# EasyEDA schematic BIT 0.json
TITLE: TRICORE | ALU | LOGIC; REV: 1.0; Date: 2022-01-05; Sheet: 2/9; Drawn By: Koehler, Paul; Company: komed3
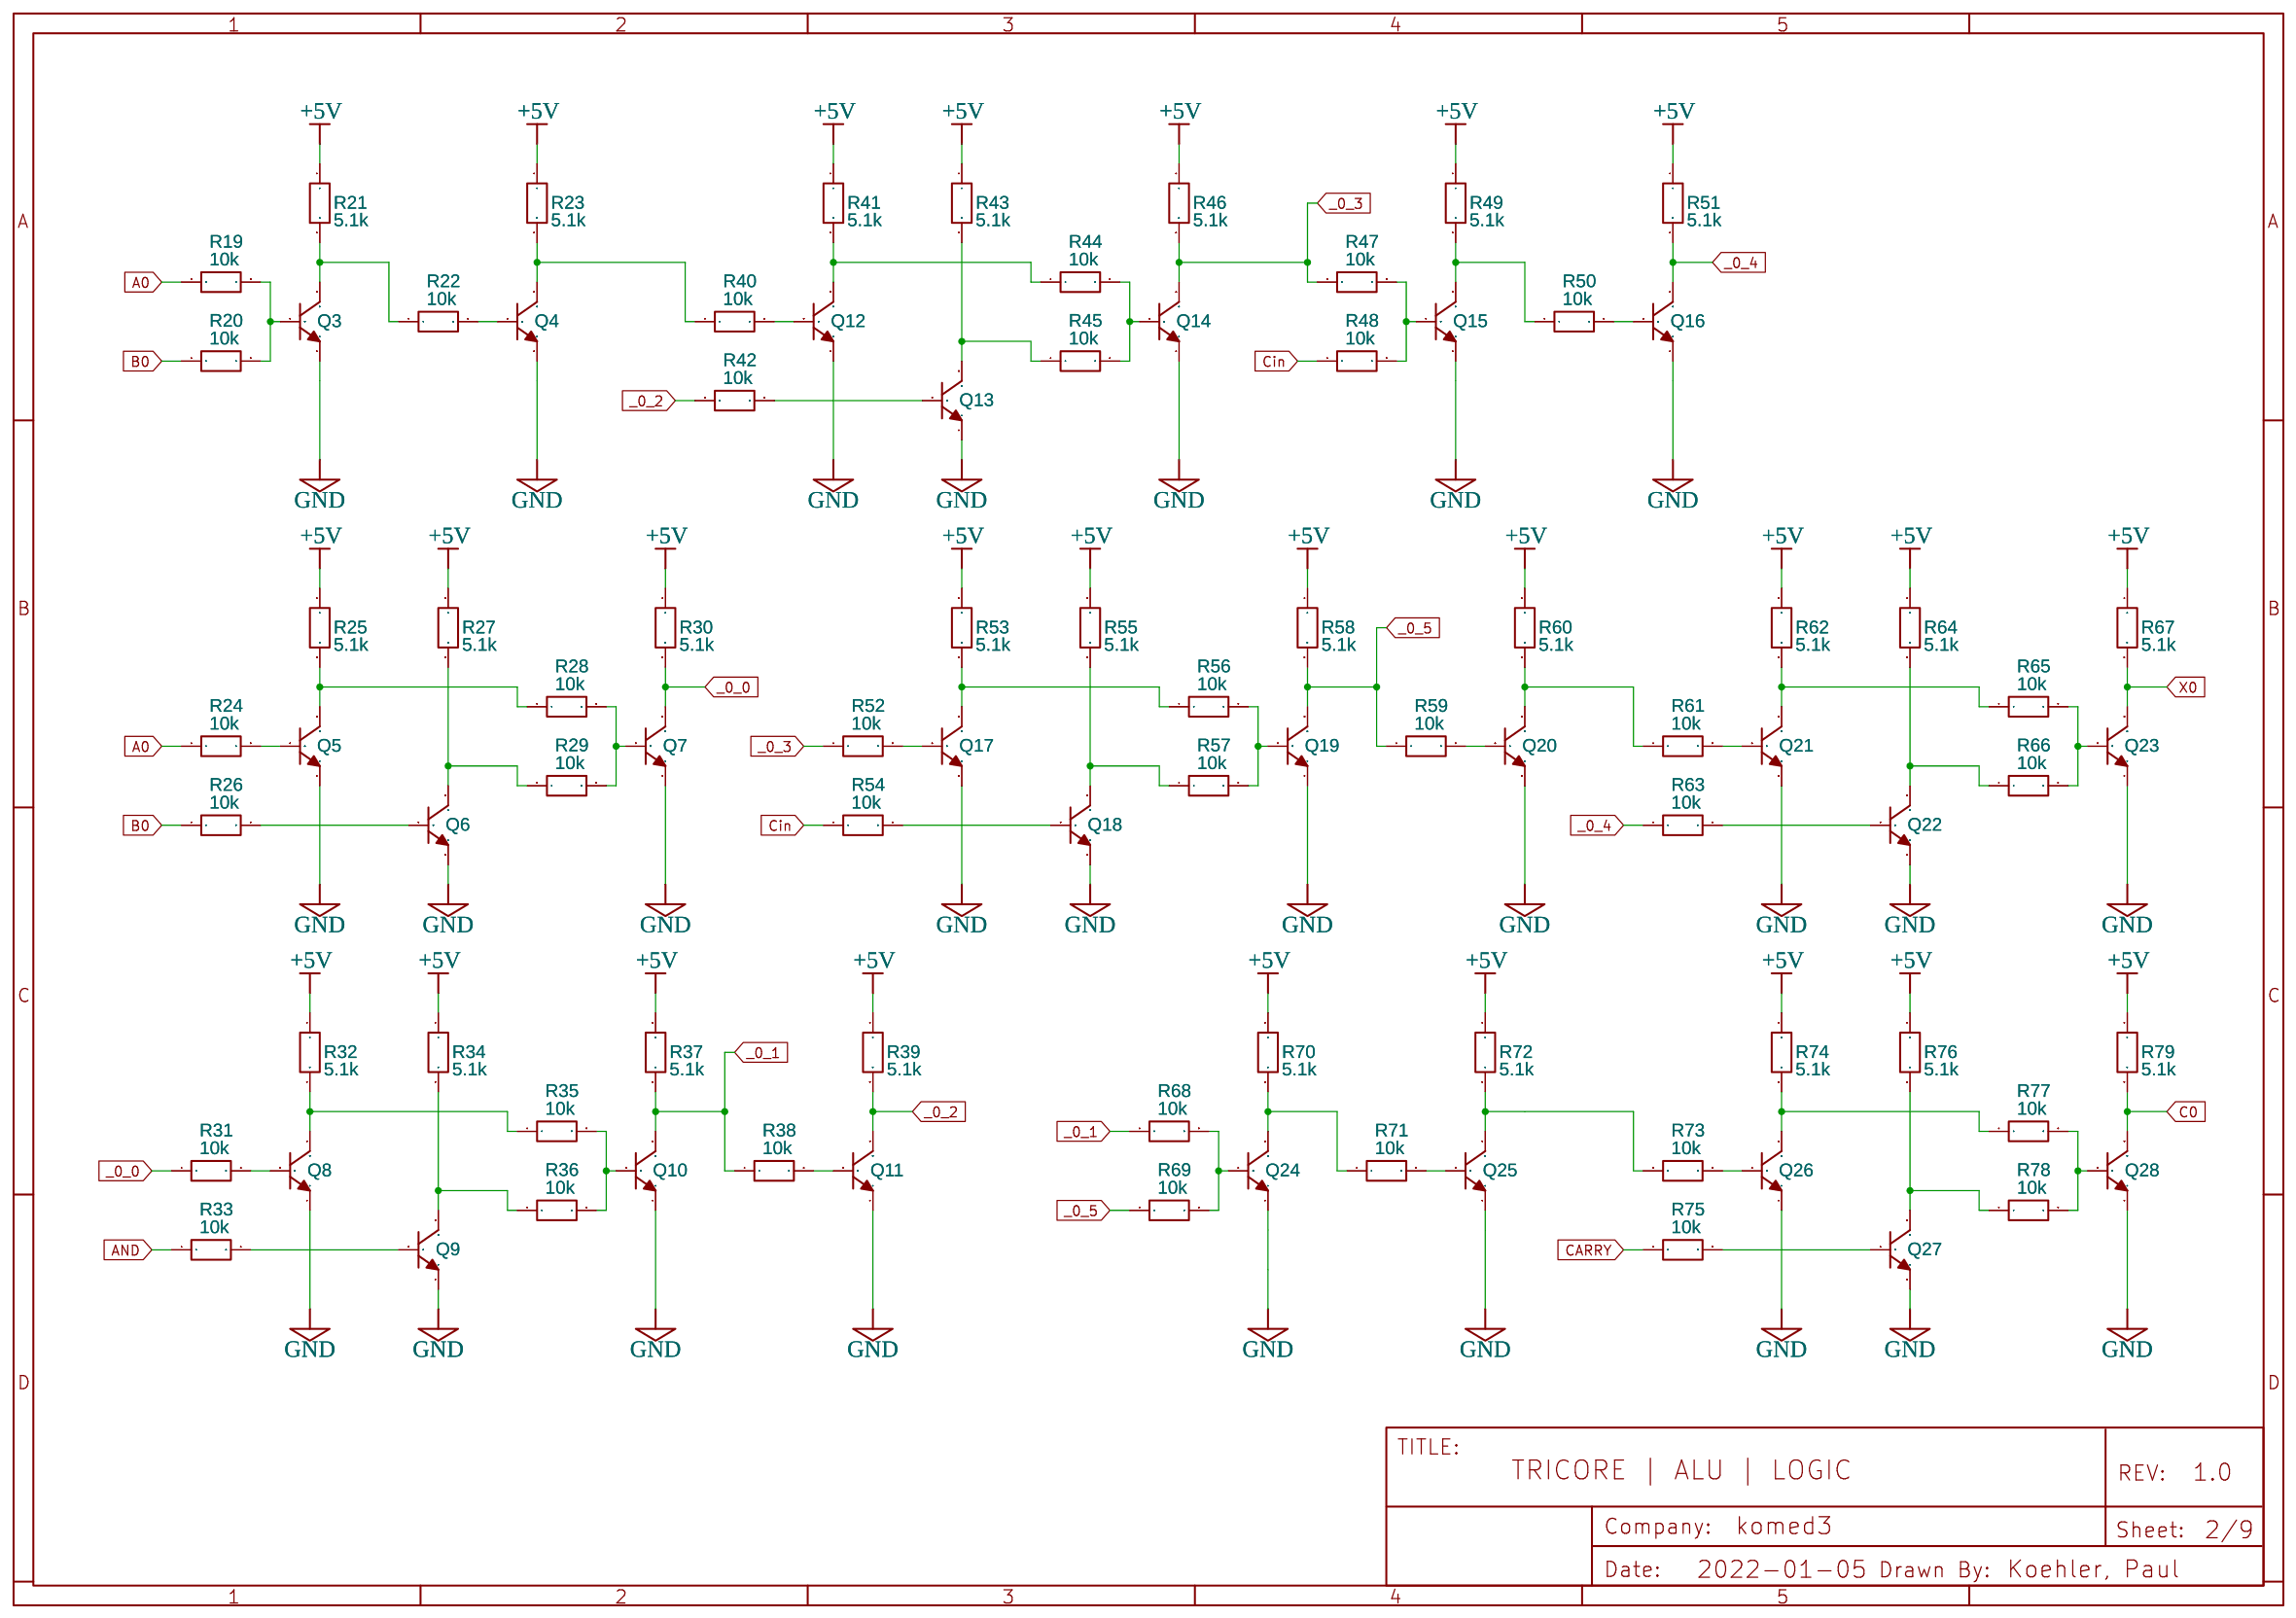
[diagram p0: schematic sheet]

## Parts
Q3  2N3904(TO-92)  [TO-92-3_L5.1-W4.1-P1.27-L]
Q4  2N3904(TO-92)  [TO-92-3_L5.1-W4.1-P1.27-L]
Q5  2N3904(TO-92)  [TO-92-3_L5.1-W4.1-P1.27-L]
Q6  2N3904(TO-92)  [TO-92-3_L5.1-W4.1-P1.27-L]
Q7  2N3904(TO-92)  [TO-92-3_L5.1-W4.1-P1.27-L]
Q8  2N3904(TO-92)  [TO-92-3_L5.1-W4.1-P1.27-L]
Q9  2N3904(TO-92)  [TO-92-3_L5.1-W4.1-P1.27-L]
Q10  2N3904(TO-92)  [TO-92-3_L5.1-W4.1-P1.27-L]
Q11  2N3904(TO-92)  [TO-92-3_L5.1-W4.1-P1.27-L]
Q12  2N3904(TO-92)  [TO-92-3_L5.1-W4.1-P1.27-L]
Q13  2N3904(TO-92)  [TO-92-3_L5.1-W4.1-P1.27-L]
Q14  2N3904(TO-92)  [TO-92-3_L5.1-W4.1-P1.27-L]
Q15  2N3904(TO-92)  [TO-92-3_L5.1-W4.1-P1.27-L]
Q16  2N3904(TO-92)  [TO-92-3_L5.1-W4.1-P1.27-L]
Q17  2N3904(TO-92)  [TO-92-3_L5.1-W4.1-P1.27-L]
Q18  2N3904(TO-92)  [TO-92-3_L5.1-W4.1-P1.27-L]
Q19  2N3904(TO-92)  [TO-92-3_L5.1-W4.1-P1.27-L]
Q20  2N3904(TO-92)  [TO-92-3_L5.1-W4.1-P1.27-L]
Q21  2N3904(TO-92)  [TO-92-3_L5.1-W4.1-P1.27-L]
Q22  2N3904(TO-92)  [TO-92-3_L5.1-W4.1-P1.27-L]
Q23  2N3904(TO-92)  [TO-92-3_L5.1-W4.1-P1.27-L]
Q24  2N3904(TO-92)  [TO-92-3_L5.1-W4.1-P1.27-L]
Q25  2N3904(TO-92)  [TO-92-3_L5.1-W4.1-P1.27-L]
Q26  2N3904(TO-92)  [TO-92-3_L5.1-W4.1-P1.27-L]
Q27  2N3904(TO-92)  [TO-92-3_L5.1-W4.1-P1.27-L]
Q28  2N3904(TO-92)  [TO-92-3_L5.1-W4.1-P1.27-L]
R19  10k  [R_AXIAL-0.3]
R20  10k  [R_AXIAL-0.3]
R21  5.1k  [R_AXIAL-0.3]
R22  10k  [R_AXIAL-0.3]
R23  5.1k  [R_AXIAL-0.3]
R24  10k  [R_AXIAL-0.3]
R25  5.1k  [R_AXIAL-0.3]
R26  10k  [R_AXIAL-0.3]
R27  5.1k  [R_AXIAL-0.3]
R28  10k  [R_AXIAL-0.3]
R29  10k  [R_AXIAL-0.3]
R30  5.1k  [R_AXIAL-0.3]
R31  10k  [R_AXIAL-0.3]
R32  5.1k  [R_AXIAL-0.3]
R33  10k  [R_AXIAL-0.3]
R34  5.1k  [R_AXIAL-0.3]
R35  10k  [R_AXIAL-0.3]
R36  10k  [R_AXIAL-0.3]
R37  5.1k  [R_AXIAL-0.3]
R38  10k  [R_AXIAL-0.3]
R39  5.1k  [R_AXIAL-0.3]
R40  10k  [R_AXIAL-0.3]
R41  5.1k  [R_AXIAL-0.3]
R42  10k  [R_AXIAL-0.3]
R43  5.1k  [R_AXIAL-0.3]
R44  10k  [R_AXIAL-0.3]
R45  10k  [R_AXIAL-0.3]
R46  5.1k  [R_AXIAL-0.3]
R47  10k  [R_AXIAL-0.3]
R48  10k  [R_AXIAL-0.3]
R49  5.1k  [R_AXIAL-0.3]
R50  10k  [R_AXIAL-0.3]
R51  5.1k  [R_AXIAL-0.3]
R52  10k  [R_AXIAL-0.3]
R53  5.1k  [R_AXIAL-0.3]
R54  10k  [R_AXIAL-0.3]
R55  5.1k  [R_AXIAL-0.3]
R56  10k  [R_AXIAL-0.3]
R57  10k  [R_AXIAL-0.3]
R58  5.1k  [R_AXIAL-0.3]
R59  10k  [R_AXIAL-0.3]
R60  5.1k  [R_AXIAL-0.3]
R61  10k  [R_AXIAL-0.3]
R62  5.1k  [R_AXIAL-0.3]
R63  10k  [R_AXIAL-0.3]
R64  5.1k  [R_AXIAL-0.3]
R65  10k  [R_AXIAL-0.3]
R66  10k  [R_AXIAL-0.3]
R67  5.1k  [R_AXIAL-0.3]
R68  10k  [R_AXIAL-0.3]
R69  10k  [R_AXIAL-0.3]
R70  5.1k  [R_AXIAL-0.3]
R71  10k  [R_AXIAL-0.3]
R72  5.1k  [R_AXIAL-0.3]
R73  10k  [R_AXIAL-0.3]
R74  5.1k  [R_AXIAL-0.3]
R75  10k  [R_AXIAL-0.3]
R76  5.1k  [R_AXIAL-0.3]
R77  10k  [R_AXIAL-0.3]
R78  10k  [R_AXIAL-0.3]
R79  5.1k  [R_AXIAL-0.3]

## Library data of the parts
Q3-Q28 = 2N3904(TO-92): Supplier: LCSC; Manufacturer: SEMTECH; Manufacturer Part: 2N3904; Supplier Part: C118538; Contributor: LCEDA_Lib
R19-R79 = R_AXIAL-0.3_EU: Contributor: LCEDA_Lib

## Nets
+5V: R21.1 R23.1 R25.1 R27.1 R30.1 R32.1 R34.1 R37.1 R39.1 R41.1 R43.1 R46.1 R49.1 R51.1 R53.1 R55.1 R58.1 R60.1 R62.1 R64.1 R67.1 R70.1 R72.1 R74.1 R76.1 R79.1
GND: Q3.1(E) Q4.1(E) Q5.1(E) Q6.1(E) Q7.1(E) Q8.1(E) Q9.1(E) Q10.1(E) Q11.1(E) Q12.1(E) Q13.1(E) Q14.1(E) Q15.1(E) Q16.1(E) Q17.1(E) Q18.1(E) Q19.1(E) Q20.1(E) Q21.1(E) Q22.1(E) Q23.1(E) Q24.1(E) Q25.1(E) Q26.1(E) Q27.1(E) Q28.1(E)
_0_0: Q7.3(C) R30.2 R31.1
_0_1: Q10.3(C) R37.2 R38.1 R68.1
_0_2: Q11.3(C) R39.2 R42.1
_0_3: Q14.3(C) R46.2 R47.1 R52.1
_0_4: Q16.3(C) R51.2 R63.1
_0_5: Q19.3(C) R58.2 R59.1 R69.1
A0: R19.1 R24.1
AND: R33.1
B0: R20.1 R26.1
C0: Q28.3(C) R79.2
CARRY: R75.1
Cin: R48.1 R54.1
X0: Q23.3(C) R67.2
Net-(Q3-2): Q3.2(B) R19.2 R20.2
Net-(Q3-3): Q3.3(C) R21.2 R22.1
Net-(Q4-2): Q4.2(B) R22.2
Net-(Q4-3): Q4.3(C) R23.2 R40.1
Net-(Q5-2): Q5.2(B) R24.2
Net-(Q5-3): Q5.3(C) R25.2 R28.1
Net-(Q6-2): Q6.2(B) R26.2
Net-(Q6-3): Q6.3(C) R27.2 R29.1
Net-(Q7-2): Q7.2(B) R28.2 R29.2
Net-(Q8-2): Q8.2(B) R31.2
Net-(Q8-3): Q8.3(C) R32.2 R35.1
Net-(Q9-2): Q9.2(B) R33.2
Net-(Q9-3): Q9.3(C) R34.2 R36.1
Net-(Q10-2): Q10.2(B) R35.2 R36.2
Net-(Q11-2): Q11.2(B) R38.2
Net-(Q12-2): Q12.2(B) R40.2
Net-(Q12-3): Q12.3(C) R41.2 R44.1
Net-(Q13-2): Q13.2(B) R42.2
Net-(Q13-3): Q13.3(C) R43.2 R45.1
Net-(Q14-2): Q14.2(B) R44.2 R45.2
Net-(Q15-2): Q15.2(B) R47.2 R48.2
Net-(Q15-3): Q15.3(C) R49.2 R50.1
Net-(Q16-2): Q16.2(B) R50.2
Net-(Q17-2): Q17.2(B) R52.2
Net-(Q17-3): Q17.3(C) R53.2 R56.1
Net-(Q18-2): Q18.2(B) R54.2
Net-(Q18-3): Q18.3(C) R55.2 R57.1
Net-(Q19-2): Q19.2(B) R56.2 R57.2
Net-(Q20-2): Q20.2(B) R59.2
Net-(Q20-3): Q20.3(C) R60.2 R61.1
Net-(Q21-2): Q21.2(B) R61.2
Net-(Q21-3): Q21.3(C) R62.2 R65.1
Net-(Q22-2): Q22.2(B) R63.2
Net-(Q22-3): Q22.3(C) R64.2 R66.1
Net-(Q23-2): Q23.2(B) R65.2 R66.2
Net-(Q24-2): Q24.2(B) R68.2 R69.2
Net-(Q24-3): Q24.3(C) R70.2 R71.1
Net-(Q25-2): Q25.2(B) R71.2
Net-(Q25-3): Q25.3(C) R72.2 R73.1
Net-(Q26-2): Q26.2(B) R73.2
Net-(Q26-3): Q26.3(C) R74.2 R77.1
Net-(Q27-2): Q27.2(B) R75.2
Net-(Q27-3): Q27.3(C) R76.2 R78.1
Net-(Q28-2): Q28.2(B) R77.2 R78.2
